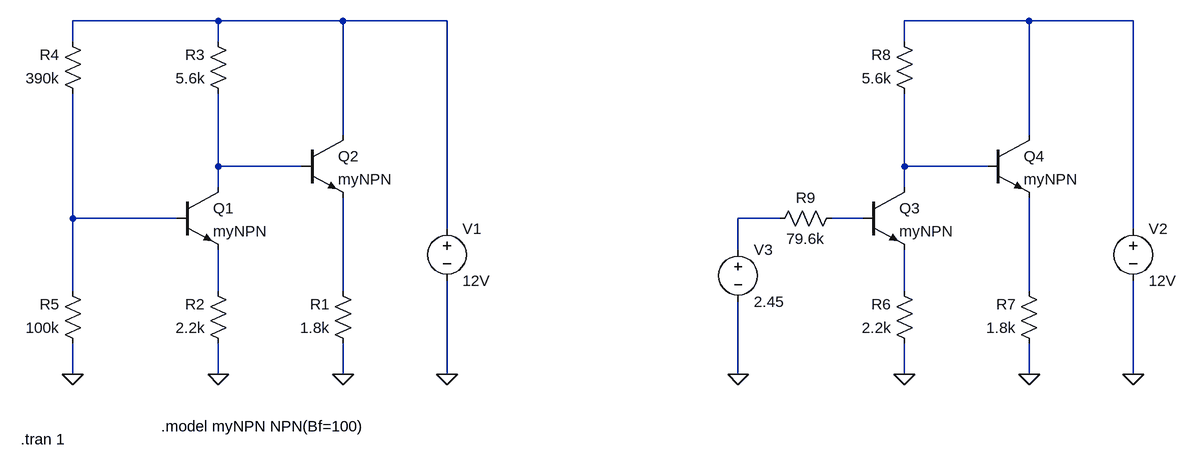
[diagram p0: schematic uebung.asc]
uebung.asc, the LTspice schematic file:
Version 4
SHEET 1 1868 720
WIRE 384 -48 160 -48
WIRE 576 -48 384 -48
WIRE 736 -48 576 -48
WIRE 1632 -48 1440 -48
WIRE 1792 -48 1632 -48
WIRE 160 -16 160 -48
WIRE 384 -16 384 -48
WIRE 1440 -16 1440 -48
WIRE 576 128 576 -48
WIRE 1632 128 1632 -48
WIRE 384 176 384 64
WIRE 512 176 384 176
WIRE 1440 176 1440 64
WIRE 1568 176 1440 176
WIRE 384 208 384 176
WIRE 1440 208 1440 176
WIRE 160 256 160 64
WIRE 320 256 160 256
WIRE 1248 256 1184 256
WIRE 1376 256 1328 256
WIRE 736 272 736 -48
WIRE 1792 272 1792 -48
WIRE 1184 304 1184 256
WIRE 160 368 160 256
WIRE 384 368 384 304
WIRE 576 368 576 224
WIRE 1440 368 1440 304
WIRE 1632 368 1632 224
WIRE 160 496 160 448
WIRE 384 496 384 448
WIRE 576 496 576 448
WIRE 736 496 736 352
WIRE 1184 496 1184 384
WIRE 1440 496 1440 448
WIRE 1632 496 1632 448
WIRE 1792 496 1792 352
FLAG 736 496 0
FLAG 384 496 0
FLAG 160 496 0
FLAG 576 496 0
FLAG 1792 496 0
FLAG 1440 496 0
FLAG 1184 496 0
FLAG 1632 496 0
SYMBOL npn 320 208 R0
SYMATTR InstName Q1
SYMATTR Value myNPN
SYMBOL voltage 736 256 R0
WINDOW 123 0 0 Left 2
WINDOW 39 0 0 Left 2
SYMATTR InstName V1
SYMATTR Value 12V
SYMBOL res 400 464 R180
WINDOW 0 36 76 Left 2
WINDOW 3 36 40 Left 2
SYMATTR InstName R2
SYMATTR Value 2.2k
SYMBOL npn 512 128 R0
SYMATTR InstName Q2
SYMATTR Value myNPN
SYMBOL res 592 464 R180
WINDOW 0 36 76 Left 2
WINDOW 3 36 40 Left 2
SYMATTR InstName R1
SYMATTR Value 1.8k
SYMBOL res 400 80 R180
WINDOW 0 36 76 Left 2
WINDOW 3 36 40 Left 2
SYMATTR InstName R3
SYMATTR Value 5.6k
SYMBOL res 176 80 R180
WINDOW 0 36 76 Left 2
WINDOW 3 36 40 Left 2
SYMATTR InstName R4
SYMATTR Value 390k
SYMBOL res 176 464 R180
WINDOW 0 36 76 Left 2
WINDOW 3 36 40 Left 2
SYMATTR InstName R5
SYMATTR Value 100k
SYMBOL npn 1376 208 R0
SYMATTR InstName Q3
SYMATTR Value myNPN
SYMBOL voltage 1792 256 R0
WINDOW 123 0 0 Left 2
WINDOW 39 0 0 Left 2
SYMATTR InstName V2
SYMATTR Value 12V
SYMBOL res 1456 464 R180
WINDOW 0 36 76 Left 2
WINDOW 3 36 40 Left 2
SYMATTR InstName R6
SYMATTR Value 2.2k
SYMBOL npn 1568 128 R0
SYMATTR InstName Q4
SYMATTR Value myNPN
SYMBOL res 1648 464 R180
WINDOW 0 36 76 Left 2
WINDOW 3 36 40 Left 2
SYMATTR InstName R7
SYMATTR Value 1.8k
SYMBOL res 1456 80 R180
WINDOW 0 36 76 Left 2
WINDOW 3 36 40 Left 2
SYMATTR InstName R8
SYMATTR Value 5.6k
SYMBOL res 1344 240 R90
WINDOW 0 0 56 VBottom 2
WINDOW 3 32 56 VTop 2
SYMATTR InstName R9
SYMATTR Value 79.6k
SYMBOL voltage 1184 288 R0
WINDOW 123 0 0 Left 2
WINDOW 39 0 0 Left 2
SYMATTR InstName V3
SYMATTR Value 2.45
TEXT 296 576 Left 2 !.model myNPN NPN(Bf=100)
TEXT 80 596 Left 2 !.tran 1

The netlist it stands for:
* uebung.asc
Q1 N003 N005 N008 0 myNPN
V1 N001 0 12V
R2 0 N008 2.2k
Q2 N001 N003 N009 0 myNPN
R1 0 N009 1.8k
R3 N003 N001 5.6k
R4 N005 N001 390k
R5 0 N005 100k
Q3 N004 N007 N010 0 myNPN
V2 N002 0 12V
R6 0 N010 2.2k
Q4 N002 N004 N011 0 myNPN
R7 0 N011 1.8k
R8 N004 N002 5.6k
R9 N007 N006 79.6k
V3 N006 0 2.45
.model NPN NPN
.model PNP PNP
.lib standard.bjt
.model myNPN NPN(Bf=100)
.tran 1
.backanno
.end